# Altium schematic sheet ble_lock_V1.2-20201223.SchDoc
size A2
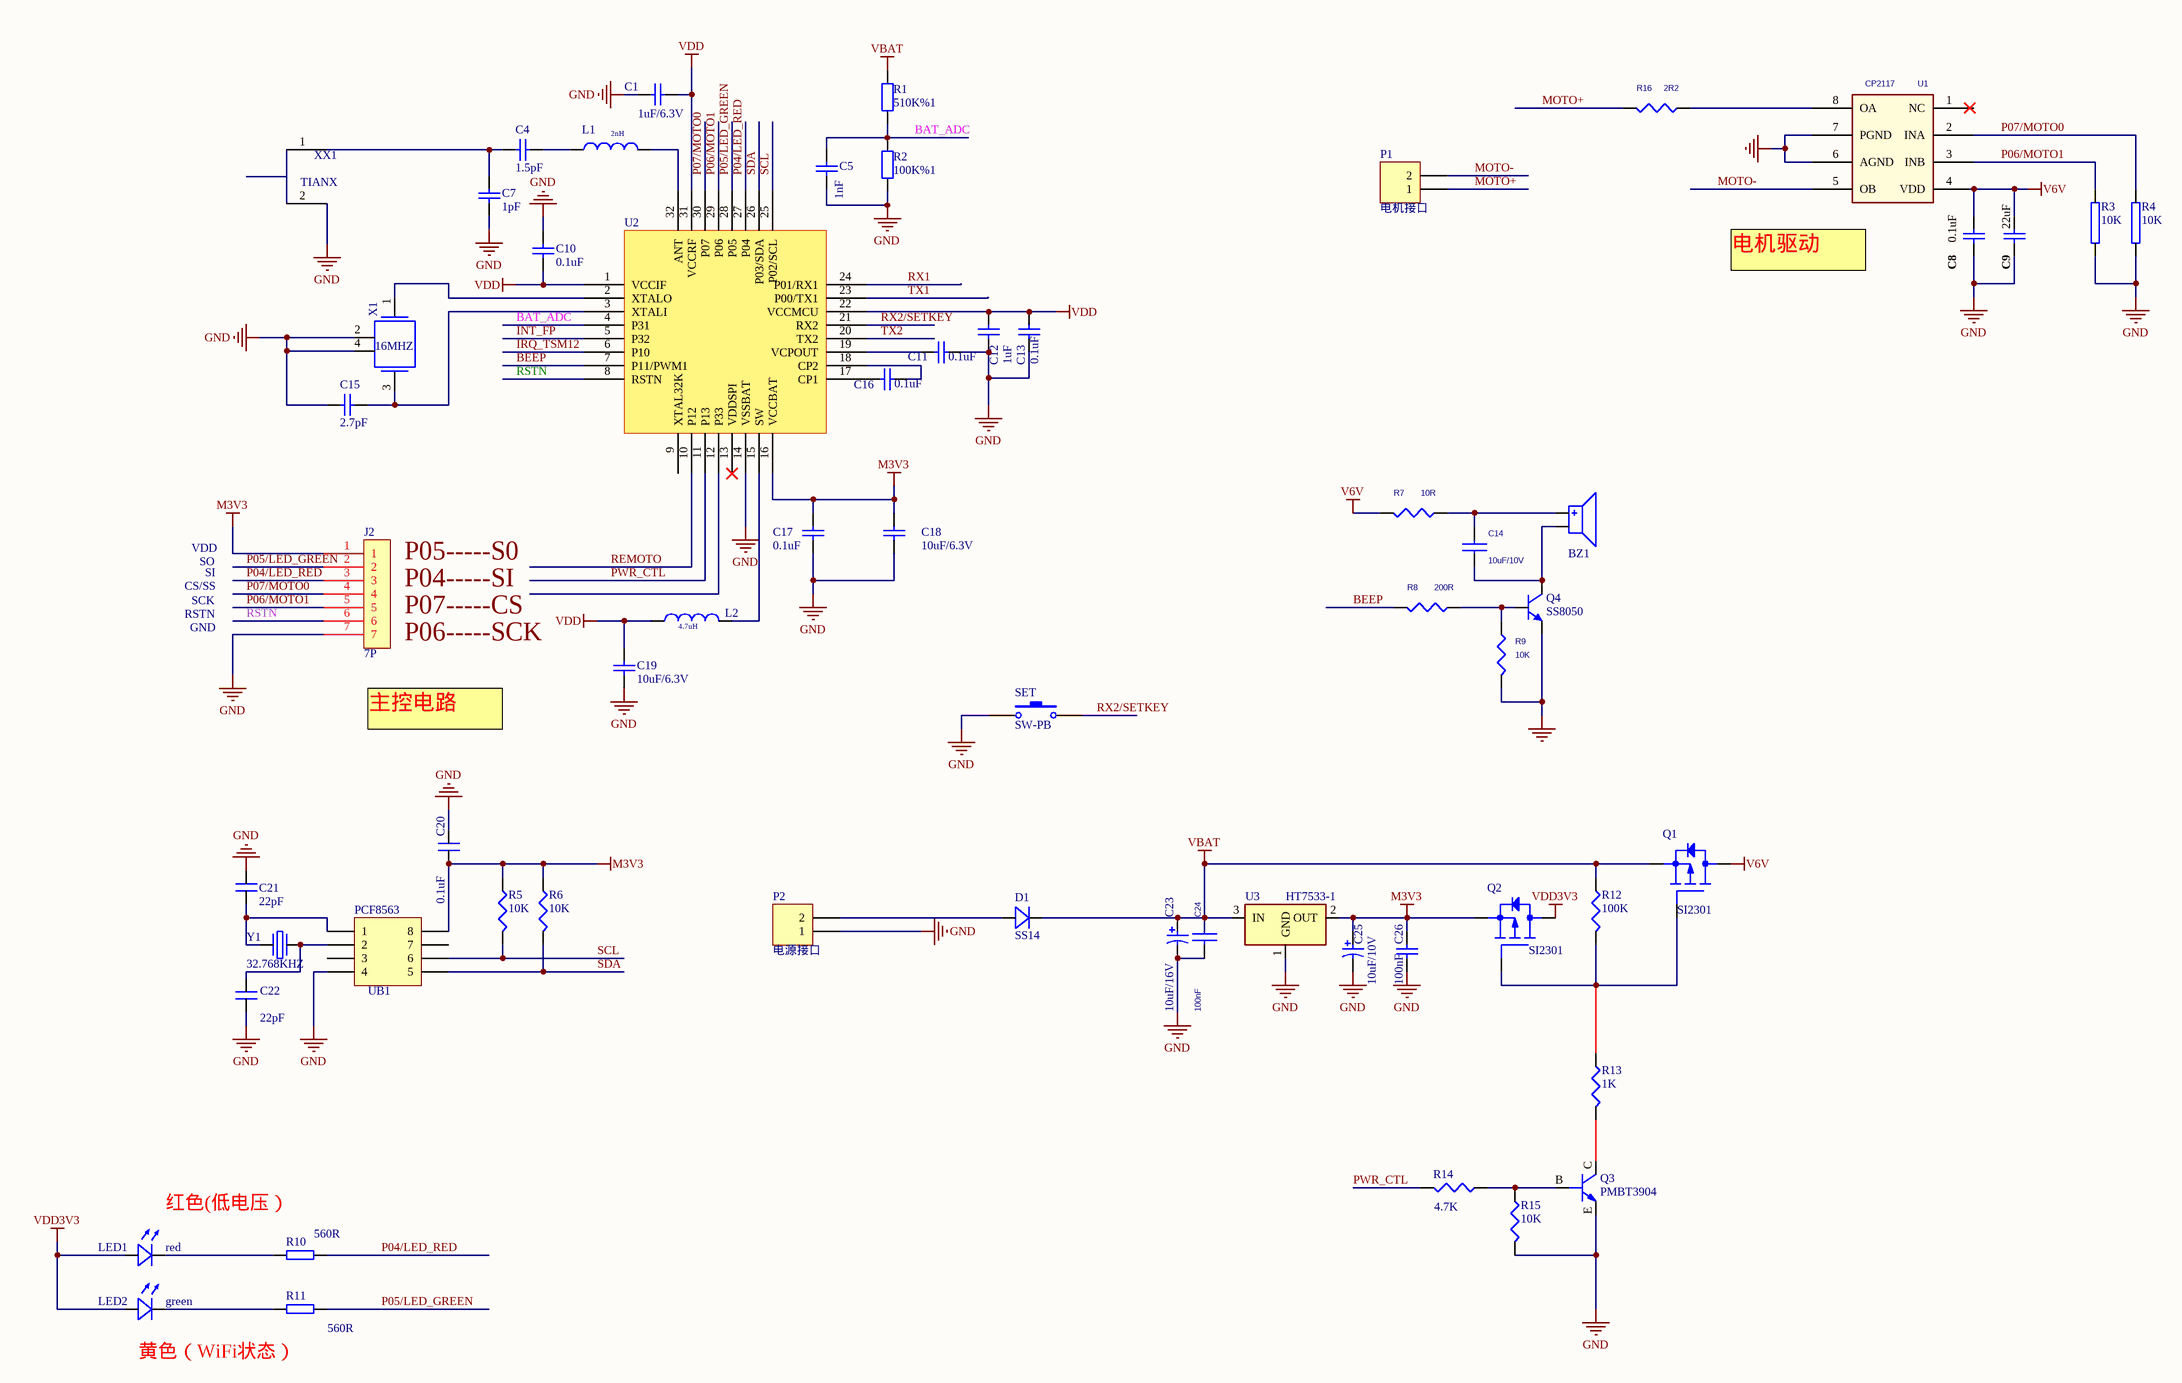
[diagram p0: ble_lock_V1.2-20201223.SchDoc]

## Parts
BZ1  BUZZER  [BUZZER_D93_L40]  (value not drawn)
C1  1uF/6.3V  [0402C]
C4  1.5pF  [0603C]
C5  1nF  [0402C]
C7  1pF  [0603C]
C8  0.1uF  [0402C]
C9  22uF  [0805C]
C10  0.1uF  [0402C]
C11  0.1uF  [0402C]
C12  1uF  [0402C]
C13  0.1uF  [0402C]
C14  10uF/10V  [0603C]
C15  2.7pF  [0402C]
C16  0.1uF  [0402C]
C17  0.1uF  [0402C]
C18  10uF/6.3V  [0603C]
C19  10uF/6.3V  [0603C]
C20  0.1uF  [0402C]
C21  22pF  [0402C]
C22  22pF  [0402C]
C23  10uF/16V  [0805C]
C24  100nF  [0603C]
C25  10uF/10V  [LC-0805_C]
C26  100nF  [0603C]
D1  SS14  [DO-214AA]
J2  7P  [7P-2.0MM]
L1  2nH  [0603L]
L2  4.7uH  [0805L]
LED1  red  [0603LED]
LED2  green  [0603LED]
P1  电机接口  [2P-1.25mm-弯脚]
P2  电源接口  [2P-1.25mm-弯脚]
Q1  SI2301  [SOT-23 - GDS]
Q2  SI2301  [SOT-23 - GDS]
Q3  PMBT3904  [SOT-23 - BCE]
Q4  SS8050  [SOT-23-3L]
R1  510K%1  [0402R]
R2  100K%1  [0402R]
R3  10K  [0402R]
R4  10K  [0402R]
R5  10K  [0402R]
R6  10K  [0402R]
R7  10R  [0402R]
R8  200R  [0402R]
R9  10K  [0402R]
R10  560R  [0402R]
R11  560R  [0402R]
R12  100K  [0402R]
R13  1K  [0402R]
R14  4.7K  [0402R]
R15  10K  [0402R]
R16  2R2  [0603R]
SET  SW-PB  [SET]
U1  CP2117  [SOP8]
U2  BK3431Q  [QFN32_4*4*0.4]  (value not drawn)
U3  HT7533-1  [SOT-23-3L]
UB1  PCF8563  [SOP8]
X1  16MHZ  [XTAL3225]
XX1  TIANX  [BT_NAMI_NO]
Y1  32.768KHZ  [晶振]

## Nets
GND: C1.1 C5.1 C7.1 C8.2 C9.2 C10.1 C11.2 C12.1 C13.1 C15.1 C17.2 C18.2 C19.1 C20.2 C21.2 C22.1 C23.2 C24.2 C25.2 C26.2 J2.7 P2.1 Q3.E(EMITTER) Q4.2 R2.2 R3.1 R4.1 R9.2 R15.2 SET.2 U1.6(AGND) U1.7(PGND) U2.14(VSSBAT) U3.1(GND) UB1.4 X1.2 X1.4 XX1.2
M3V3: C17.1 C18.1 C20.1 C25.1 C26.1 J2.1 Q2.S(SOURCE) R5.1 R6.1 U2.16(VCCBAT) U3.2(OUT) UB1.8
V6V: C8.1 C9.1 Q1.D(DRAIN) R7.2 U1.4(VDD)
VBAT: C23.1 C24.1 D1.2(K) Q1.S(SOURCE) R1.1 R12.1 U3.3(IN)
VDD: C1.2 C10.2 C12.2 C13.2 C19.2 L2.1(P1) U2.1(VCCIF) U2.22(VCCMCU) U2.31(VCCRF)
VDD3V3: LED1.1 LED2.1 Q2.D(DRAIN)
BAT_ADC: C5.2 R1.2 R2.1 U2.4(P31)
BEEP: R8.2 U2.7(P11/PWM1)
INT_FP: U2.5(P32)
IRQ_TSM12: U2.6(P10)
MOTO+: P1.1 R16.2
MOTO-: P1.2 U1.5(OB)
P04/LED_RED: J2.3 R10.2 U2.27(P04)
P05/LED_GREEN: J2.2 R11.2 U2.28(P05)
P06/MOTO1: J2.5 R3.2 U1.3(INB) U2.29(P06)
P07/MOTO0: J2.4 R4.2 U1.2(INA) U2.30(P07)
PWR_CTL: R14.2 U2.11(P13)
REMOTO: U2.10(P12)
RSTN: J2.6 U2.8(RSTN)
RX1: U2.24(P01/RX1)
RX2/SETKEY: SET.1 U2.21(RX2)
SCL: R5.2 U2.25(P02/SCL) UB1.6
SDA: R6.2 U2.26(P03/SDA) UB1.5
TX1: U2.23(P00/TX1)
TX2: U2.20(TX2)
NetBZ1_1: BZ1.1 C14.2 R7.1
NetBZ1_2: BZ1.2 C14.1 Q4.3
NetC4_1: C4.1 L1.1(P1)
NetC4_2: C4.2 C7.2 XX1.1
NetC11_1: C11.1 U2.19(VCPOUT)
NetC15_2: C15.2 U2.3(XTALI) X1.3
NetC16_1: C16.1 U2.17(CP1)
NetC16_2: C16.2 U2.18(CP2)
NetC21_1: C21.1 UB1.1 Y1.2
NetC22_2: C22.2 UB1.2 Y1.1
NetD1_1: D1.1(A) P2.2
NetL1_2: L1.2(P2) U2.32(ANT)
NetL2_2: L2.2(P2) U2.15(SW)
NetLED1_2: LED1.2 R10.1
NetLED2_2: LED2.2 R11.1
NetQ1_G: Q1.G(GATE) Q2.G(GATE) R12.2 R13.1
NetQ3_B: Q3.B(BASE) R14.1 R15.1
NetQ3_C: Q3.C(COLLECTOR) R13.2
NetQ4_1: Q4.1 R8.1 R9.1
NetR16_1: R16.1 U1.8(OA)
NetU2_2: U2.2(XTALO) X1.1

Not connected (* = marked no-connect by the designer): U1 1(NC); U2 9(XTAL32K) 12(P33) 13(VDDSPI)*; UB1 3 7

## Notes on the sheet
- (near U1) 电机驱动
- CS/SS
- SCK
- VDD
- SO
- SI
- (near J2) P04-----SI
- (near J2) P05-----S0
- RSTN
- GND
- (near J2) P06-----SCK
- (near J2) P07-----CS
- 主控电路
- 红色(低电压）
- (near LED2) 黄色（WiFi状态）

## Library data of the parts
C1 C4 C7 C10-C13 C15-C19 = Cap: Capacitor; Value: 10pF; Published: 8-Jun-2000; LatestRevisionDate: 17-Jul-2002; LatestRevisionNote: Re-released for DXP Platform.; PackageReference: RAD-0.3; Publisher: Altium Limited; PackageDescription: Radial Cap, Thru-Hole; 2 Leads; 0.3 in Pin Spacing
C5 C8 C9 C26 = CAP-NP: Capacitor, Ceramic; Capacitance: 18 pF; Dielectric: COG; Polarity: Non-Polarized; Rated Voltage: 50 mV; Tolerance: 5 %; Category: Capacitor; Mounting Technology: Surface Mount; Status: Unreleased; Technology: Ceramic
C14 = C_0_Dup1
C20-C22 = C
C23 C25 = CAP-P: Capacitor, tolerance ±20%
C24 = CAP NP
D1 = D
L1 L2 = INDUCTOR: Power Inductor, 4.7uH, 0.7A, 260mR DCR; XMOS Part Number: E-09-0011; Manufacturer: Taiyo Yuden; Manufacturer Part Number: CBC2518T4R7M; Part Creator: JG; LEVEL: STD; DEVICE: L; FORWARD_PCB: 1; Tolerance (%): 20; Max DC Resistance: 0.26R; Rated Current (Saturation): 0.68A; Rated Current (Temp Rise): 0.92A; Approx Volume Cost ($): 0.07; Approved: NO; VALUE: 2.0nH; Datasheet: http://www.yuden.co.jp/us/product/pdf/ecb2_e.pdf; Max Height (mm): 2; Digikey Link: http://search.digikey.com/scripts/DkSearch/dksus.dll?lang=en&site=US&keywords=CBC2518T4R7M
LED1 LED2 = LED
P1 P2 = Header 2: Header, 2-Pin; LatestRevisionDate: 17-Jul-2002; LatestRevisionNote: Re-released for DXP Platform.; Publisher: Altium Limited
Q1 Q2 = PWRMOSFET_EP_DGS_0
Q4 = NPN_BJT: Bipolar Junction Transistor
R1 R2 = Res2: Resistor; Value: 470K; Published: 2013年12月24日; LatestRevisionDate: 2013年12月24日; LatestRevisionNote: Re-released for DXP Platform.
R3 R4 = Pro71C3.TMP_UnNamed_1
R5 R6 R10-R15 = R
R7-R9 R16 = R_Dup1
SET = SW-PB: Switch; Published: 24-Mar-1999; LatestRevisionDate: 17-Jul-2002; LatestRevisionNote: Re-released for DXP Platform.; PackageReference: SPST-2; Publisher: Altium Limited
U1 = AM24LC02_0
U3 = XC6206P302M
UB1 = IC8
X1 = OSC: XMOS Part Number: E-07-0030; Manufacturer: Abracon; Manufacturer Part Number: ABLS-24.000MHz-B4; Part Creator: JG; LEVEL: STD; DEVICE: X; FORWARD_PCB: 1; Approx Volume Cost ($): 0.15; Approved: NO; VALUE: ABLS; FREQUENCY: 38.4MHZ; Datasheet: http://www.abracon.com/Resonators/abls.pdf; Max Height (mm): 4.2; Supplier Link: http://search.digikey.com/scripts/DkSearch/dksus.dll?lang=en&site=US&keywords=ABLS-24.000MHz-B4
Y1 = 晶振